# EAGLE design vl4e3p (EAGLE 6.5.0)
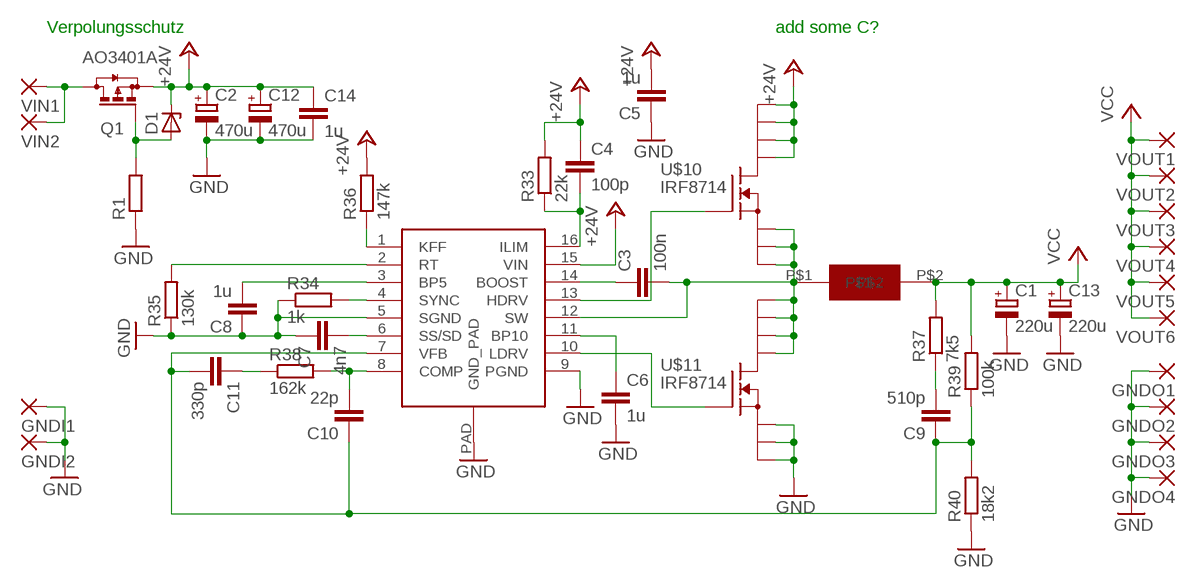
[diagram p0: schematic, sheet 1]

## Parts
C1  220u  CPOL-EUE3.5-8  [E3,5-8]
C2  470u  CPOL-EUE3.5-8  [E3,5-8]
C3  100n  C-EUC0805S  [C0805S]
C4  100p  C-EUC0805  [C0805]
C5  1u  C-EUC0805  [C0805]
C6  1u  C-EUC0805  [C0805]
C7  4n7  C-EUC0805  [C0805]
C8  1u  C-EUC0805  [C0805]
C9  510p  C-EUC0805  [C0805]
C10  22p  C-EUC0805  [C0805]
C11  330p  C-EUC0805  [C0805]
C12  470u  CPOL-EUE3.5-8  [E3,5-8]
C13  220u  CPOL-EUE3.5-8  [E3,5-8]
C14  1u  C-EUC0805  [C0805]
D1  ZENER-DIODESOT23  [SOT23]
GNDI1  PAD5-2,5  WIREPADSMD5-2,5  [5-2,5]
GNDI2  PAD5-2,5  WIREPADSMD5-2,5  [5-2,5]
GNDO1  PAD5-2,5  WIREPADSMD5-2,5  [5-2,5]
GNDO2  PAD5-2,5  WIREPADSMD5-2,5  [5-2,5]
GNDO3  PAD5-2,5  WIREPADSMD5-2,5  [5-2,5]
GNDO4  PAD5-2,5  WIREPADSMD5-2,5  [5-2,5]
Q1  AO3401A  BSS84  [SOT23]
R1  R-EU_R0805  [R0805]
R33  22k  R-EU_R0805  [R0805]
R34  1k  R-EU_R0805  [R0805]
R35  130k  R-EU_R0805  [R0805]
R36  147k  R-EU_R0805  [R0805]
R37  7k5  R-EU_R0805  [R0805]
R38  162k  R-EU_R0805  [R0805]
R39  100k  R-EU_R0805  [R0805]
R40  18k2  R-EU_R0805  [R0805]
U$1  6u8  L  [FOO]
U$9  TPS40055  [TSSOP16]
U$10  IRF8714  [SO8]
U$11  IRF8714  [SO8]
VIN1  PAD5-2,5  WIREPADSMD5-2,5  [5-2,5]
VIN2  PAD5-2,5  WIREPADSMD5-2,5  [5-2,5]
VOUT1  PAD5-2,5  WIREPADSMD5-2,5  [5-2,5]
VOUT2  PAD5-2,5  WIREPADSMD5-2,5  [5-2,5]
VOUT3  PAD5-2,5  WIREPADSMD5-2,5  [5-2,5]
VOUT4  PAD5-2,5  WIREPADSMD5-2,5  [5-2,5]
VOUT5  PAD5-2,5  WIREPADSMD5-2,5  [5-2,5]
VOUT6  PAD5-2,5  WIREPADSMD5-2,5  [5-2,5]

## Nets
+24V: C2.+ C4.1 C5.2 C12.+ C14.1 D1.3(C) Q1.2(S) R33.2 R36.2 U$9.15(VIN) U$10.5(D) U$10.6(D) U$10.7(D) U$10.8(D)
BOOST: C3.1 U$9.14(BOOST)
BP10: C6.1 U$9.11(BP10)
C3: C8.2 U$9.3(BP5)
COMP: C10.2 R38.2 U$9.8(COMP)
GND: C1.- C2.- C5.1 C6.2 C7.1 C8.1 C12.- C13.- C14.2 GNDI1.1(P) GNDI2.1(P) GNDO1.1(P) GNDO2.1(P) GNDO3.1(P) GNDO4.1(P) R1.1 R34.1 R35.1 R40.1 U$9.5(SGND) U$9.9(PGND) U$9.PAD(GND_PAD) U$11.1(S) U$11.2(S) U$11.3(S)
HDRV: U$9.13(HDRV) U$10.4(G)
ILIM: C4.2 R33.1 U$9.16(ILIM)
KFF: R36.1 U$9.1(KFF)
LDRV: U$9.10(LDRV) U$11.4(G)
N$2: C11.1 R38.1
N$3: C9.2 R37.1
N$4: D1.1(A) Q1.1(G) R1.2
RT: R35.2 U$9.2(RT)
SS/SD: C7.2 U$9.6(SS/SD)
SW: C3.2 U$1.P$1 U$9.12(SW) U$10.1(S) U$10.2(S) U$10.3(S) U$11.5(D) U$11.6(D) U$11.7(D) U$11.8(D)
SYNC: R34.2 U$9.4(SYNC)
VCC: C1.+ C13.+ R37.2 R39.2 U$1.P$2 VOUT1.1(P) VOUT2.1(P) VOUT3.1(P) VOUT4.1(P) VOUT5.1(P) VOUT6.1(P)
VFB: C9.1 C10.1 C11.2 R39.1 R40.2 U$9.7(VFB)
VIN: Q1.3(D) VIN1.1(P) VIN2.1(P)

## Notes on the sheet
- Verpolungsschutz | add some C?

## Library data of the parts
C1 C2 C12 C13 = rcl:CPOL-EU: POLARIZED CAPACITOR, European symbol
C3 = rcl_patch:C-EU: CAPACITOR, European symbol
C4-C11 C14 = rcl:C-EU: CAPACITOR, European symbol
D1 = diode:ZENER-DIODE: Z-Diode
GNDI1 GNDI2 GNDO1-GNDO4 VIN1 VIN2 VOUT1-VOUT6 = wirepad:WIREPAD: Wire PAD connect wire on PCB
Q1 = transistor-small-signal:BSS84: P-CHANNEL MOS FET
R1 R33-R40 = rcl:R-EU_: RESISTOR, European symbol
U$1 = ihlp-4040dz-er-4r7:L
U$9 = tps40055:TPS40055
U$10 U$11 = irf8714:IRF8714

## Board
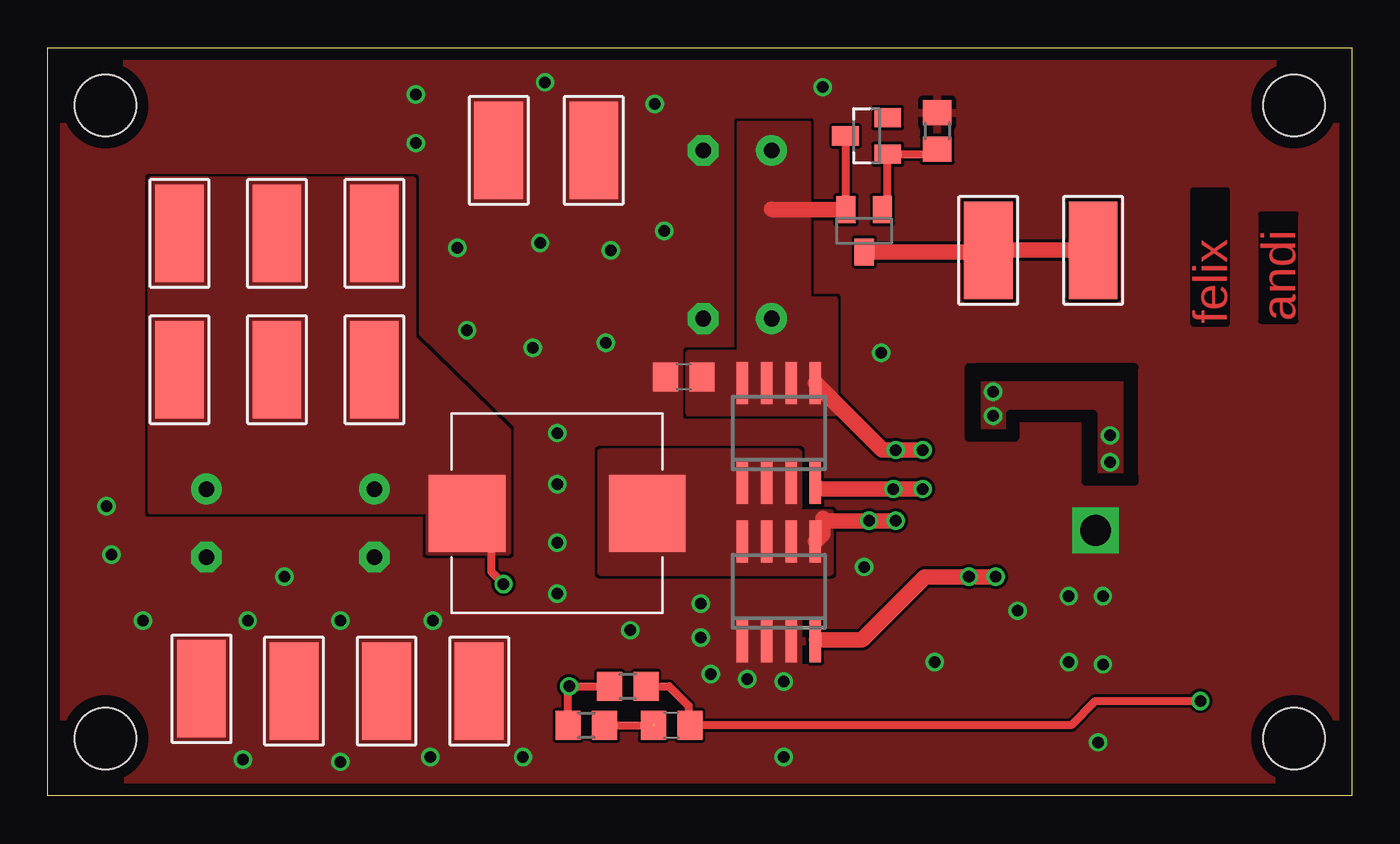
[diagram p1: board, top side]
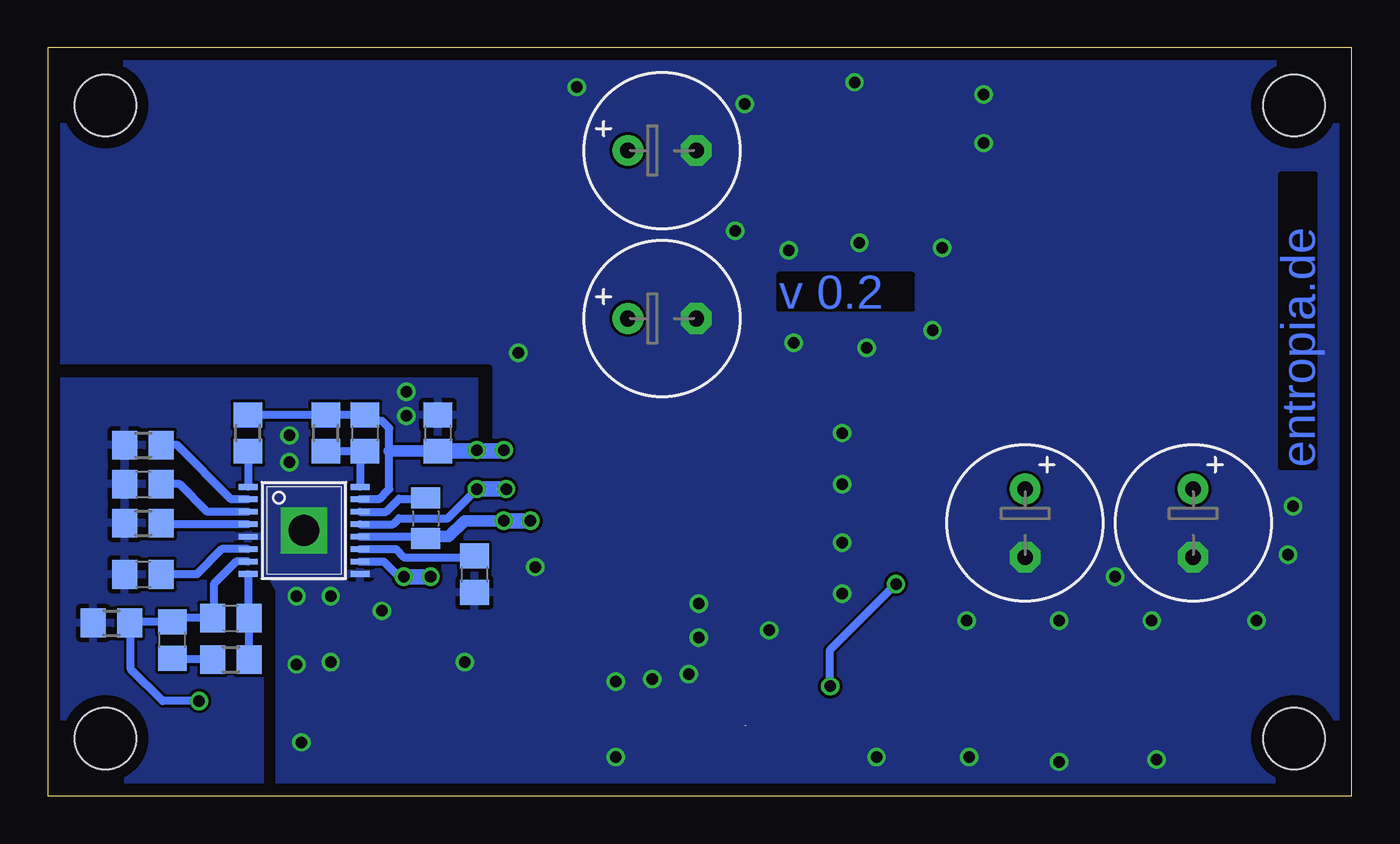
[diagram p2: board, bottom side, seen from below]

Size 67.95 x 39 mm. Coordinates in mm from the lower left corner, seen from the top.
Outline: 0,39 67.95,39 67.95,0 0,0 0,39
Copper layers (1*16): Top 0.0356mm / dielectric 1.5011mm / Bottom 0.0356mm
Design rules "default": minimum track width 6mil, minimum drill 13mil, track to track 6mil, track to pad 6mil, pad to pad 6mil, via to via 6mil, smd to smd 6mil, copper to edge 25mil, drill to drill 6mil, minimum pad ring 7mil, minimum via ring 7mil, stop-mask expansion 4mil, vias tented up to drill 0mil, thermal gap 10mil
Holes 3.2 mm at 3,36 64.95,36 3,3 64.95,3
tRestrict: area 48.4,16.6 to 56.6,22.4; area 48,16.4 to 56.6,22.4
bRestrict: area 45,-1 to 68.5,22.4

### Footprints (pad centres in the part's own frame; a part is rotated, then mirrored left to right if it is on the bottom)
E3,5-8 = drill 0.813 pad 1.6: + -1.778,0 | drill 0.813 pad 1.6 octagon: - 1.778,0
C0805S = smd 1.1 x 1.5: 1 -1.05,0; 2 1.05,0
C0805 = smd 1.3 x 1.5: 1 -0.95,0; 2 0.95,0
SOT23 = smd 1 x 1.4: 1 -0.95,-1.1; 2 0.95,-1.1; 3 0,1.1
5-2,5 = smd 2.54 x 5.08: 1 0,0
R0805 = smd 1.3 x 1.5: 1 -0.95,0; 2 0.95,0
FOO = smd 4 x 4: P$1 -4.7,0; P$2 4.7,0
TSSOP16 = smd 0.305 x 0.991: 1 -2.275,-2.918; 2 -1.625,-2.918; 3 -0.975,-2.918; 4 -0.325,-2.918; 5 0.325,-2.918; 6 0.975,-2.918; 7 1.625,-2.918; 8 2.275,-2.918; 9 2.275,2.918; 10 1.625,2.918; 11 0.975,2.918; 12 0.325,2.918; 13 -0.325,2.918; 14 -0.975,2.918; 15 -1.625,2.918; 16 -2.275,2.918 | drill 1.6 square: PAD 0,0
SO8 = smd 0.6 x 2.2: 1 -1.905,-2.6; 2 -0.635,-2.6; 3 0.635,-2.6; 4 1.905,-2.6; 5 1.905,2.6; 6 0.635,2.6; 7 -0.635,2.6; 8 -1.905,2.6

### Placement (x,y rotation side)
C1  17.02,14.22 270 bottom
C2  35.94,24.89 0 bottom
C3  48.26,14.48 270 bottom
C4  51.44,18.92 270 bottom
C5  47.62,18.92 270 bottom
C6  45.72,11.56 270 bottom
C7  62.99,11.56 0 bottom
C8  62.99,16.26 0 bottom
C9  32.51,3.68 180 top
C10  58.42,9.27 0 bottom
C11  61.47,8.13 90 bottom
C12  35.94,33.66 0 bottom
C13  8.26,14.22 270 bottom
C14  33.15,21.84 180 top
D1  42.67,34.42 90 top
GNDI1  28.45,33.66 180 top
GNDI2  23.5,33.66 180 top
GNDO1  22.48,5.46 180 top
GNDO2  17.65,5.46 180 top
GNDO3  12.83,5.46 180 top
GNDO4  8,5.59 180 top
Q1  42.55,29.46 180 top
R1  46.35,34.67 270 top
R33  53.47,18.92 90 bottom
R34  62.99,14.22 0 bottom
R35  62.99,18.29 0 bottom
R36  57.53,18.92 90 bottom
R37  28.07,3.68 180 top
R38  58.42,7.11 0 bottom
R39  30.23,5.71 180 top
R40  64.64,9.02 0 bottom
U$1  26.54,14.73 180 top
U$9  54.61,13.84 270 bottom
U$10  38.1,18.92 0 top
U$11  38.1,10.67 0 top
VIN1  49.02,28.45 180 top
VIN2  54.48,28.45 180 top
VOUT1  6.86,29.34 180 top
VOUT2  11.94,29.34 180 top
VOUT3  17.02,29.34 180 top
VOUT4  6.86,22.23 180 top
VOUT5  11.94,22.23 180 top
VOUT6  17.02,22.23 180 top

### Tracks (layer width: path | path; a pad name or v marks a point on that pad's centre or on a via)
+24V  (via drill 0.6)
  Top 0.406: D1.3 41.57,30.59 Q1.2
  Top 0.813: v45.59,18.03 v44.2,18.03 43.49,18.03 U$10.5 | Q1.2 37.76,30.56 37.72,30.61
  Bottom 0.305: 50.8,19.56 51.12,19.87 C4.1
  Bottom 0.406: C4.1 R33.2 R36.2 | U$9.15 50.7,15.47 50.16,16 50.16,17.97 50.16,19.18 50.55,19.56 50.8,19.56
  Bottom 0.61: C5.2 50.16,17.97
  Bottom 0.813: v44.2,18.03 44.26,17.97 47.44,17.97 47.5,18.03 47.62,18.03 C5.2
  pour Top (no thermals): 41.02,19.94 33.4,19.94 33.4,23.11 36.07,23.11 36.07,35.05 39.62,35.05 39.62,25.91 41.02,25.91
BOOST
  Bottom 0.406: U$9.14 50.33,14.82 49.66,15.49 48.26,15.49 C3.1
BP10
  Bottom 0.406: U$9.11 49.83,12.87 49.4,12.45 45.78,12.45 C6.1
C3
  Bottom 0.406: U$9.3 59.65,14.82 61.09,16.26 C8.2
COMP
  Bottom 0.406: R38.2 C10.2 57.53,9.33 U$9.8
GND  (via drill 0.6)
  other vias: 49.28,21.08 55.37,18.8 55.37,17.4 54.99,10.41 53.21,10.41 26.54,16.26 26.54,13.21 26.54,18.92 26.54,10.54 34.04,10.03 34.04,8.26 34.54,6.35 38.35,5.97 36.45,6.1 54.99,6.86 53.21,6.99 50.55,9.65 42.55,11.94 25.27,23.37 21.34,28.57 19.18,36.58 19.18,34.04 12.32,11.43 15.24,9.14 4.95,9.14 19.94,2.03 3.05,15.11 29.34,28.45 32.13,29.46 31.62,36.08 3.3,12.57 10.16,1.91 54.74,2.79 38.35,2.03 43.43,23.11 10.41,9.14 20.07,9.14 30.35,8.64 25.65,28.84 49.28,19.81 29.08,23.62 40.39,36.96 15.24,1.78 24.77,2.03 46.23,6.99 25.91,37.21 21.84,24.27
  pour Top (rank 4): -1.27,40.04 69.14,40.04 69.14,-1.27 -1.27,-1.27
  pour Bottom (rank 4): -1.27,40.04 69.14,40.04 69.14,-1.27 -1.27,-1.27
  pour Top (no thermals): 39.12,9.27 35.69,9.27 35.69,6.86 39.12,6.86
  pour Top (no thermals): 24.77,2.16 24.77,9.14 5.97,9.14 5.97,2.16
  pour Top (no thermals): 21.08,36.72 30.73,36.72 30.73,29.97 21.08,29.97
  pour Bottom (no thermals): 32.64,35.05 35.18,35.05 35.18,24 32.64,24
  pour Top (no thermals): 32.64,35.05 35.18,35.05 35.18,24 32.64,24
  pour Top (no thermals): 6.6,13.97 18.54,13.97 18.54,10.92 6.6,10.92
  pour Bottom (no thermals): 6.48,14.1 18.54,14.1 18.54,10.67 6.48,10.67
  pour Top (no thermals): 30.61,23.37 32.89,23.37 32.89,19.81 30.61,19.81
HDRV  (via drill 0.6)
  Top 0.61: 40.33,16 U$10.4
  Top 0.813: v45.59,16 v44.07,16 40.33,16
  Bottom 0.406: U$9.13 49.97,14.17 49.66,14.48 47.12,14.48 v45.59,16
  Bottom 0.813: v45.59,16 v44.07,16
ILIM
  Bottom 0.305: C4.2 51.69,17.72
  Bottom 0.406: R33.1 C4.2 | 51.69,17.72 U$9.16
KFF
  Bottom 0.305: R36.1
  Bottom 0.406: R36.1 U$9.1
LDRV  (via drill 0.6)
  Top 0.406: 40.06,8.13 U$11.4
  Top 0.813: v49.4,11.43 v48.01,11.43 45.72,11.43 42.42,8.13 40.06,8.13
  Bottom 0.406: U$9.10 50.45,12.22 49.66,11.43 v49.4,11.43
  Bottom 0.813: v49.4,11.43 v48.01,11.43
N$2
  Bottom 0.305: 61.4,7.11 C11.1
  Bottom 0.406: R38.1 61.4,7.11
N$3  (1 unrouted)
  Top 0.406: R37.1 31.62,3.68
N$4
  Top 0.406: Q1.1 43.77,30.84 D1.1 46.1,33.47 R1.2
RT
  Bottom 0.406: U$9.2 58.39,15.47 61.21,18.29 R35.2
SS/SD
  Bottom 0.406: U$9.6 58.89,12.87 60.2,11.56 C7.2
SW  (via drill 0.6)
  Top 0.813: v44.2,14.35 v42.8,14.35 40.51,14.35 40.39,14.48 40.39,13.65 U$11.5
  Bottom 0.406: U$9.12 48.27,13.52 | C3.2 48.13,13.43 48.13,13.52
  Bottom 0.61: 48.27,13.52 48.13,13.52 47.06,13.52 46.23,14.35 v44.2,14.35
  Bottom 0.813: v44.2,14.35 v42.8,14.35
  pour Top (no thermals): 39.12,17.91 28.83,17.91 28.83,11.68 40.77,11.68 40.77,14.73 39.12,14.73
SYNC
  Bottom 0.305: 61.99,14.17 R34.2
  Bottom 0.406: U$9.4 61.99,14.17
VCC  (via drill 0.6)
  Top 0.406: R37.2 27.12,5.65 v27.18,5.71 R39.2 | v23.75,11.05 23.11,11.68 23.11,13.46 U$1.P$2
  Bottom 0.406: v27.18,5.71 27.18,7.62 v23.75,11.05
  pour Top (no thermals): 5.33,32.13 5.33,14.86 19.81,14.86 19.81,12.7 24,12.7 24,19.05 19.05,23.88 19.05,32.13
VFB  (via drill 0.6)
  Top 0.406: C9.1 33.4,3.68 | C9.1 53.34,3.68 54.61,4.95 v60.07,4.95 | R39.1 32.38,5.71 33.4,4.7 33.4,3.74 C9.1
  Bottom 0.305: 61.27,9.27 C11.2
  Bottom 0.406: 61.27,9.27 C10.1 59.31,9.33 59.31,11.05 58.14,12.22 U$9.7 | C11.2 63.63,9.08 R40.2 63.63,8.95 63.63,6.6 61.98,4.95 v60.07,4.95
VIN
  Top 0.305: 48.94,28.36 VIN1.1
  Top 0.813: Q1.3 48.94,28.36 | VIN1.1 VIN2.1

### Text on the board
Top: felix | andi
Bottom: v 0.2 | entropia.de